# Altium schematic sheet positionsensing.SchDoc
size A
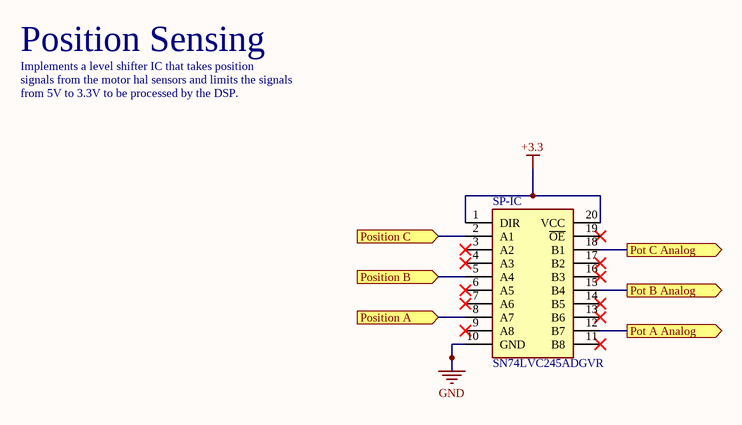
[diagram p0: positionsensing.SchDoc]

## Parts
SP-IC  SN74LVC245ADGVR  [SOP40P640X120-20N]

## Ports
Position A (in), Position B (in), Position C (in), Pot A Analog (out), Pot B Analog (out), Pot C Analog (out)

## Nets
+3.3: SP-IC.1(DIR) SP-IC.20(VCC)
GND: SP-IC.10(GND)
Position A: SP-IC.8(A7) ; port Position A
Position B: SP-IC.5(A4) ; port Position B
Position C: SP-IC.2(A1) ; port Position C
Pot A Analog: SP-IC.12(B7) ; port Pot A Analog
Pot B Analog: SP-IC.15(B4) ; port Pot B Analog
Pot C Analog: SP-IC.18(B1) ; port Pot C Analog

Not connected (* = marked no-connect by the designer): SP-IC 3(A2)* 4(A3)* 6(A5)* 7(A6)* 9(A8)* 11(B8)* 13(B6)* 14(B5)* 16(B3)* 17(B2)* 19(~{OE})*

## Notes on the sheet
- Position Sensing
- Implements a level shifter IC that takes position
- signals from the motor hal sensors and limits the signals
- from 5V to 3.3V to be processed by the DSP.

## Library data of the parts
SP-IC = SN74LVC245ADGVR: Integrated Circuit; Manufacturer_Name: Texas Instruments; Datasheet Link: http://www.ti.com/lit/gpn/sn74lvc245a; Height: 1.2mm; Manufacturer_Part_Number: SN74LVC245ADGVR; Mouser Part Number: 595-SN74LVC245ADGVR; Mouser Price/Stock: https://www.mouser.co.uk/ProductDetail/Texas-Instruments/SN74LVC245ADGVR?qs=OorDGPQ79ErH2VKzCctyvg%3D%3D; Arrow Part Number: SN74LVC245ADGVR; Arrow Price/Stock: https://www.arrow.com/en/products/sn74lvc245adgvr/texas-instruments